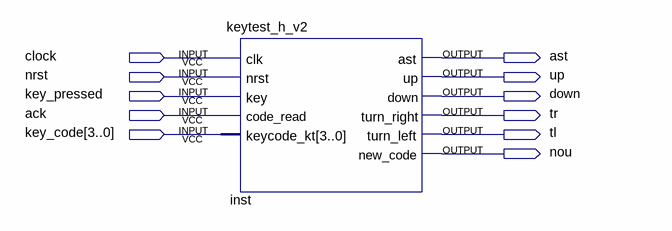
[diagram p0: schematic sheet]
// Quartus schematic debug_keytest.bdf as structural Verilog: 1 symbols, 11 pins
module debug_keytest (
  input  clock,
  input  nrst,
  input  key_pressed,
  input  ack,
  input  [3:0] key_code,
  output ast,
  output up,
  output down,
  output tr,
  output tl,
  output nou
);

  keytest_h_v2 inst (
    .clk(clock), .nrst(nrst), .key(key_pressed), .code_read(ack), .keycode_kt(key_code), .ast(ast), .up(up),
    .down(down), .turn_right(tr), .turn_left(tl), .new_code(nou));
endmodule
